# Altium schematic sheet LF_Sensor_Board.schdoc
size 306 x 233 mm
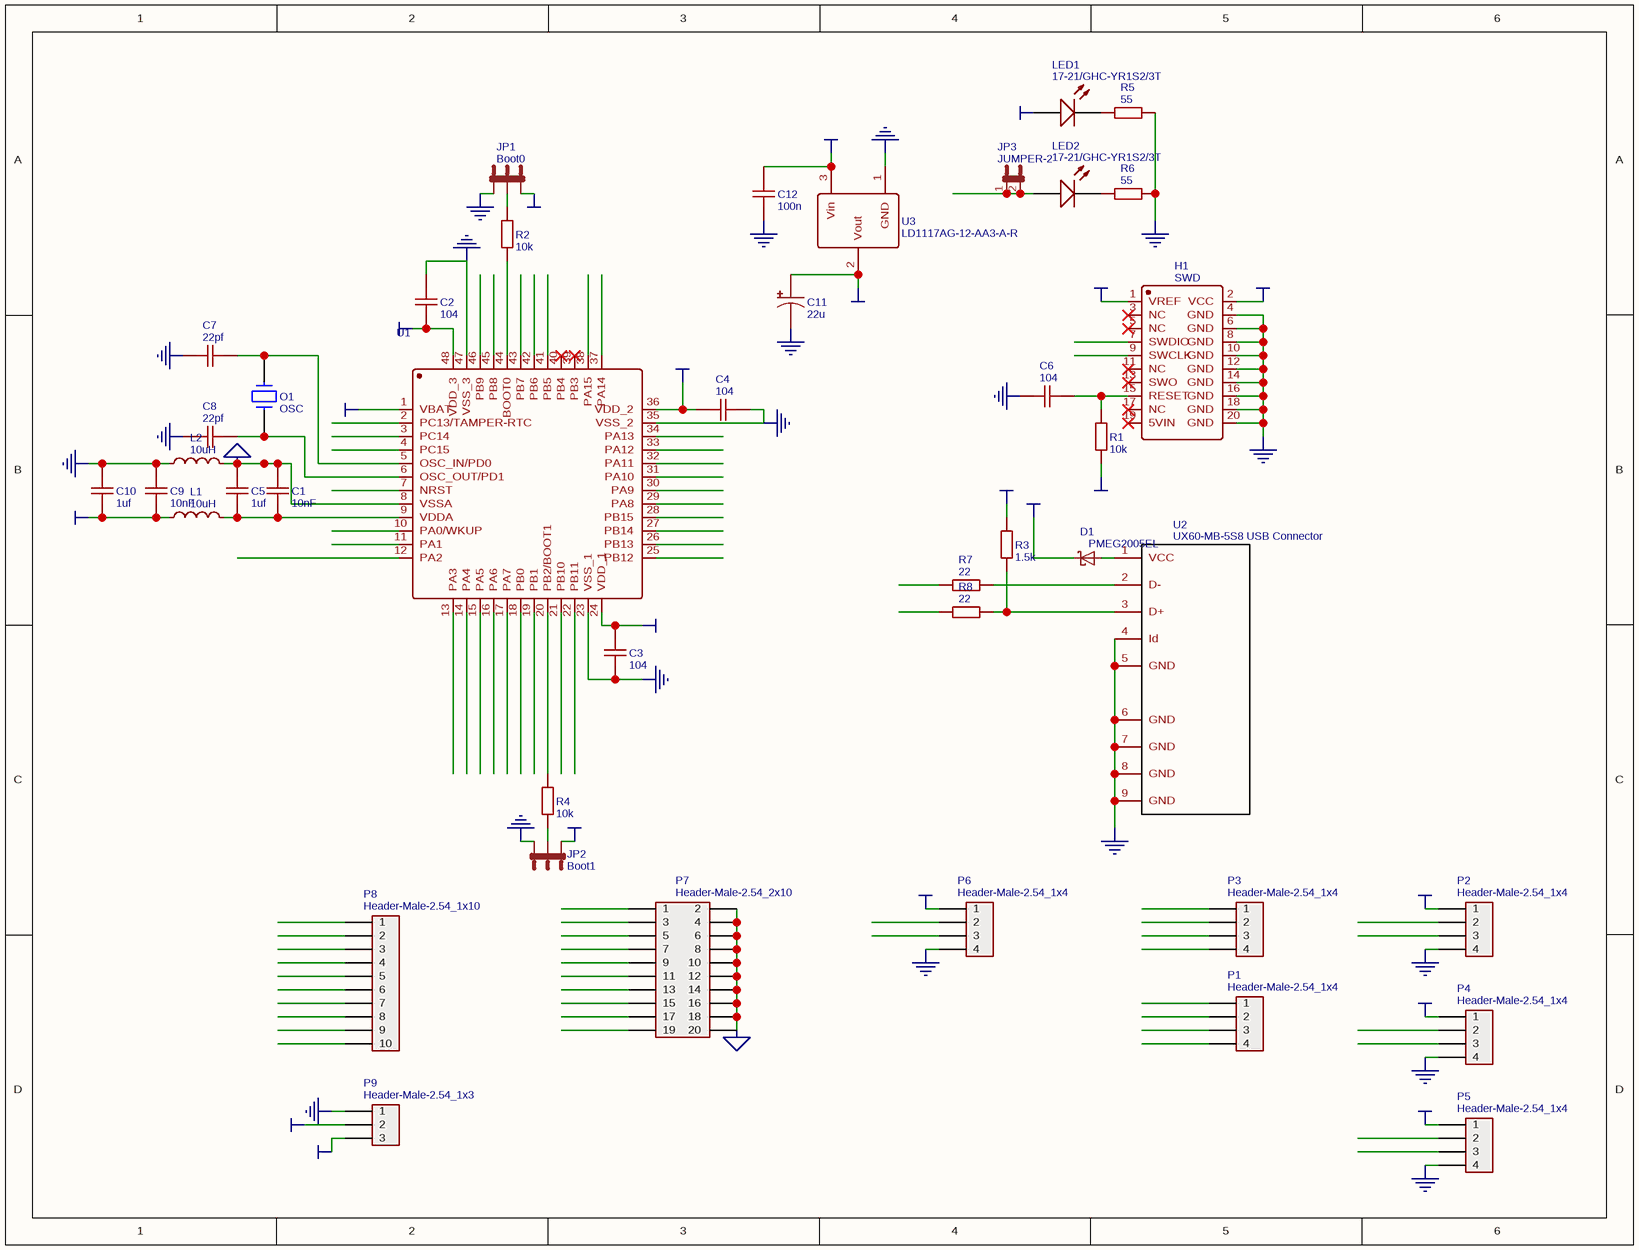
[diagram p0: LF_Sensor_Board.schdoc]

## Parts
C1  10nF  [C0603]
C2  104  [C0603]
C3  104  [C0603]
C4  104  [C0603]
C5  1uf  [C0805]
C6  104  [C0603]
C7  22pf  [C0603]
C8  22pf  [C0603]
C9  10nF  [C0603]
C10  1uf  [C0805]
C11  22u  [C0805]
C12  100n  [C0603]
D1  PMEG2005EL  [SOD882(T)]
H1  SWD  [2X10_2.54MM_PTH]
JP1  Boot0  [1X03]
JP2  Boot1  [1X03]
JP3  JUMPER-2  [SJ_2S]
L1  10uH  [AXIAL-0.4]
L2  10uH  [AXIAL-0.4]
LED1  17-21/GHC-YR1S2/3T  [LED-0805]
LED2  17-21/GHC-YR1S2/3T  [LED-0805]
O1  OSC  [SMD-2]
P1  Header-Male-2.54_1x4  [HDR-4X1/2.54]
P2  Header-Male-2.54_1x4  [HDR-4X1/2.54]
P3  Header-Male-2.54_1x4  [HDR-4X1/2.54]
P4  Header-Male-2.54_1x4  [HDR-4X1/2.54]
P5  Header-Male-2.54_1x4  [HDR-4X1/2.54]
P6  Header-Male-2.54_1x4  [HDR-4X1/2.54]
P7  Header-Male-2.54_2x10  [HDR-10X2/2.54]
P8  Header-Male-2.54_1x10  [HDR-10X1/2.54]
P9  Header-Male-2.54_1x3  [HDR-3X1/2.54]
R1  10k  [R0603]
R2  10k  [R0603]
R3  1.5k  [R0603]
R4  10k  [R0603]
R5  55  [R0603]
R6  55  [R0603]
R7  22  [R0603]
R8  22  [R0603]
U1  STM32F103C8T6  [STM-LQFP48]  (value not drawn)
U2  UX60-MB-5S8 USB Connector  [UX60-MB-5S8 USB CONNECTOR]
U3  LD1117AG-12-AA3-A-R  [SOT-223]

## Nets
NetC1_2: C1.2 C2.1 C2.2 C3.1 C3.2 C4.1 C4.2 C5.2 C6.2 C7.1 C8.1 C9.1 C9.2 C10.1 C10.2 C11.1 C11.2 C12.1 C12.2 D1.1(K) H1.1(VREF) H1.2(VCC) H1.4(GND) H1.6(GND) H1.8(GND) H1.10(GND) H1.12(GND) H1.14(GND) H1.16(GND) H1.18(GND) H1.20(GND) JP1.1 JP1.3 JP2.1 JP2.3 L1.1 L2.1 L2.2 LED1.1(A) P2.1 P2.4 P4.1 P4.4 P5.1 P5.4 P6.1 P6.4 P7.2 P7.4 P7.6 P7.8 P7.10 P7.12 P7.14 P7.16 P7.18 P7.20 P9.1 P9.2 P9.3 R1.1 R3.2 R5.2 R6.2 U1.1(VBAT) U1.8(VSSA) U1.23(VSS_1) U1.24(VDD_1) U1.35(VSS_2) U1.36(VDD_2) U1.47(VSS_3) U1.48(VDD_3) U2.4(Id) U2.5(GND) U2.6(GND) U2.7(GND) U2.8(GND) U2.9(GND) U3.1(GND) U3.2(Vout) U3.3(Vin)
NetC1_1: C1.1 C5.1 L1.2 U1.9(VDDA)
NetC6_1: C6.1 H1.15(RESET) R1.2
NetC7_2: C7.2 O1.2 U1.5(OSC_IN/PD0)
NetC8_2: C8.2 O1.1 U1.6(OSC_OUT/PD1)
NetD1_2: D1.2(A) U2.1(VCC)
NetJP1_2: JP1.2 R2.2
NetJP2_2: JP2.2 R4.2
NetJP3_1: JP3.1 JP3.2 LED2.1(A)
NetLED1_2: LED1.2(C) R5.1
NetLED2_2: LED2.2(C) R6.1
NetR2_1: R2.1 U1.44(BOOT0)
NetR3_1: R3.1 R8.2 U2.3(D+)
NetR4_1: R4.1 U1.20(PB2/BOOT1)
NetR7_2: R7.2 U2.2(D-)

Not connected (* = marked no-connect by the designer): H1 3(NC)* 5(NC)* 7(SWDIO) 9(SWCLK) 11(NC)* 13(SWO)* 17(NC)* 19(5VIN)*; P1 1 2 3 4; P2 2 3; P3 1 2 3 4; P4 2 3; P5 2 3; P6 2 3; P7 1 3 5 7 9 11 13 15 17 19; P8 1 2 3 4 5 6 7 8 9 10; R7 1; R8 1; U1 2(PC13/TAMPER-RTC) 3(PC14) 4(PC15) 7(NRST) 10(PA0/WKUP) 11(PA1) 12(PA2) 13(PA3) 14(PA4) 15(PA5) 16(PA6) 17(PA7) 18(PB0) 19(PB1) 21(PB10) 22(PB11) 25(PB12) 26(PB13) 27(PB14) 28(PB15) 29(PA8) 30(PA9) 31(PA10) 32(PA11) 33(PA12) 34(PA13) 37(PA14) 38(PA15) 39(PB3)* 40(PB4)* 41(PB5) 42(PB6) 43(PB7) 45(PB8) 46(PB9)

## Library data of the parts
C1 C9 = 10nF: nameAlias: Value(F); BOM_Manufacturer Part: ?; spicePre: C; spiceSymbolName: Capacitor
C2-C4 C6 = 104: nameAlias: Value(F); BOM_Manufacturer Part: ?; spicePre: C; spiceSymbolName: Capacitor
C5 C10 = 1uf: nameAlias: Value(F); BOM_Manufacturer Part: ?; spicePre: C; spiceSymbolName: Capacitor
C7 C8 = 22pf: nameAlias: Value(F); BOM_Manufacturer Part: ?; spicePre: C; spiceSymbolName: Capacitor
C11 = 22u: nameAlias: Value(F); BOM_Manufacturer Part: ?; spicePre: C; spiceSymbolName: Capacitor
C12 = 100n: nameAlias: Value(F); BOM_Manufacturer Part: ?; spicePre: C; spiceSymbolName: Capacitor
D1 = PMEG2005EL: catid: 20; BOM_Manufacturer Part: ?; spicePre: D
H1 = SWD: sourceId: 4amWw5FDd; spicePre: X; timeStamp: 1462691569; BOM_Manufacturer Part: ?
JP1 = Boot0: catid: 20; Contributor: SparkFun; BOM_Manufacturer Part: ?; spicePre: J
JP2 = Boot1: catid: 20; Contributor: SparkFun; BOM_Manufacturer Part: ?; spicePre: J
JP3 = JUMPER-2: catid: 20; Contributor: SparkFun; BOM_Manufacturer Part: ?; spicePre: J
L1 L2 = 10uH: nameAlias: Value(H); BOM_Manufacturer Part: ?; spicePre: L; spiceSymbolName: Inductor
LED1 LED2 = 17-21/GHC-YR1S2/3T: BOM_Manufacturer: EVERLIGHT; BOM_Supplier: EasyEDA; BOM_Manufacturer Part: 17-21/GHC-YR1S2/3T; spicePre: L; BOM_Supplier Part: E73546
O1 = OSC: catid: 20; description: 晶振; sourceId: eqICUc6M4; BOM_Manufacturer Part: ?; spicePre: O
P1-P6 = Header-Male-2.54_1x4: BOM_Manufacturer: EasyEDA; BOM_Supplier: EasyEDA; BOM_Manufacturer Part: Header-Male-2.54_1x4; spicePre: P; BOM_Supplier Part: E59481
P7 = Header-Male-2.54_2x10: BOM_Manufacturer: EasyEDA; BOM_Supplier: EasyEDA; BOM_Manufacturer Part: Header-Male-2.54_2x10; spicePre: P; BOM_Supplier Part: E62032
P8 = Header-Male-2.54_1x10: BOM_Manufacturer: EasyEDA; BOM_Supplier: EasyEDA; BOM_Manufacturer Part: Header-Male-2.54_1x10; spicePre: P; BOM_Supplier Part: E57369
P9 = Header-Male-2.54_1x3: BOM_Manufacturer: EasyEDA; BOM_Supplier: EasyEDA; BOM_Manufacturer Part: Header-Male-2.54_1x3; spicePre: P; BOM_Supplier Part: E49257
R1 R2 R4 = 10k: nameAlias: Value(Ω); BOM_Manufacturer Part: ?; spicePre: R; spiceSymbolName: Resistor
R3 = 1.5k: nameAlias: Value(Ω); BOM_Manufacturer Part: ?; spicePre: R; spiceSymbolName: Resistor
R5 R6 = 55: nameAlias: Value(Ω); BOM_Manufacturer Part: ?; spicePre: R; spiceSymbolName: Resistor
R7 R8 = 22: nameAlias: Value(Ω); BOM_Manufacturer Part: ?; spicePre: R; spiceSymbolName: Resistor
U1 = STM32F103C8T6: sourceId: nsEecMmVT; spicePre: X; timeStamp: 1466642914; BOM_Manufacturer Part: ?
U2 = UX60-MB-5S8 USB Connector: Contributor: fbruckm; sourceId: IEMGAR93X; BOM_Manufacturer Part: ?; spicePre: U
U3 = LD1117AG-12-AA3-A-R: BOM_Manufacturer: UTC; BOM_Supplier: EasyEDA; BOM_Manufacturer Part: LD1117AG-12-AA3-A-R; spicePre: U; BOM_Supplier Part: E75486